# EAGLE design Powerboard (EAGLE 9.3.0)
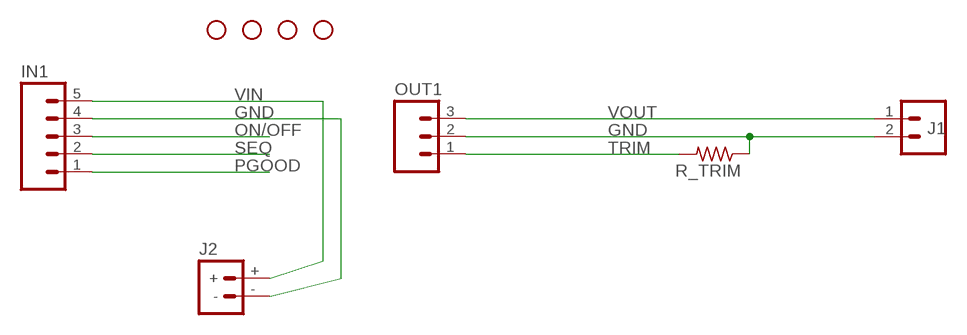
[diagram p0: schematic, sheet 1]

## Parts
IN1  M05PTH  [1X05]
J1  CONN_023.5MM  [SCREWTERMINAL-3.5MM-2]
J2  BATTERY_CONN_DEANS  [DEANS]
OUT1  M03PTH  [1X03]
R_TRIM  R-US_R0603  [R0603]
U$2  STAND-OFF  [STAND-OFF]
U$6  STAND-OFF  [STAND-OFF]
U$7  STAND-OFF  [STAND-OFF]
U$8  STAND-OFF  [STAND-OFF]

## Nets
GND: IN1.4 J1.2 J2.- OUT1.2 R_TRIM.1
ON/OFF: IN1.3
PGOOD: IN1.1
SEQ: IN1.2
TRIM: OUT1.1 R_TRIM.2
VIN: IN1.5 J2.+
VOUT: J1.1 OUT1.3

## Library data of the parts
IN1 = SparkFun:M05: Header 5 Standard 5-pin 0.1" header. Use with straight break away headers (SKU : PRT-00116), right angle break away headers (PRT-00553), swiss pins (PRT-00743), machine pins (PRT-00117), and female headers (PRT-00115). Molex polarized connector foot print use with SKU : PRT-08230 with associated crimp pins and housings.
J1 = SparkFun-Connectors:CONN_02: Multi connection point. Often used as Generic Header-pin footprint for 0.1 inch spaced/style header connections On any of the 0.1 inch spaced packages, you can populate with these: Break Away Headers - Straight <https://www.sparkfun.com/products/116> (PRT-00116) Break Away Male Headers - Right Angle <https://www.sparkfun.com/products/553> (PRT-00553) Female Headers <https://www.sparkfun.com/products/115> (PRT-00115) Break Away Headers - Machine Pin <https://www.sparkfun.com/products/117> (PRT-00117) Break Away Female Headers - Swiss Machine Pin <https://www.sparkfun.com/products/743> (PRT-00743) For SCREWTERMINALS and SPRING TERMINALS visit here: Screw Terimnals on SparkFun.com <https://www.sparkfun.com/search/results?term=Screw+Terminals> (5mm/3.5mm/2.54mm spacing) This device is also useful as a general connection point to wire up your design to another part of your project. Our various solder wires solder well into these plated through hole pads. Hook-Up Wire - Assortment (Stranded, 22 AWG) <https://www.sparkfun.com/products/11375> (PRT-11375) Hook-Up Wire - Assortment (Solid Core, 22 AWG) <https://www.sparkfun.com/products/11367> (PRT-11367) View the entire wire category on our website here <https://www.sparkfun.com/categories/141> Special notes: Molex polarized connector foot print use with: PRT-08233 with associated crimp pins and housings. 2.54_SCREWTERM for use with PRT-10571. 3.5mm Screw Terminal footprints for PRT-08084 5mm Screw Terminal footprints for use with PRT-08432; PROD_ID: CONN-08399
J2 = SparkFun-Connectors:BATTERY_CONN: Battery Connectors Various footprints for battery connections SparkFun Products: Deans Connector -M/F Pair <https://www.sparkfun.com/products/11864>; SF_ID: PRT-11864
OUT1 = SparkFun:M03: Header 3 Standard 3-pin 0.1" header. Use with straight break away headers (SKU : PRT-00116), right angle break away headers (PRT-00553), swiss pins (PRT-00743), machine pins (PRT-00117), and female headers (PRT-00115). Molex polarized connector foot print use with SKU : PRT-08232 with associated crimp pins and housings.
R_TRIM = rcl:R-US_: RESISTOR, American symbol; SPICEPREFIX: R
U$2 U$6-U$8 = SparkFun:STAND-OFF: Stand Off This is the mechanical footprint for a #4 phillips button head screw. Use the keepout ring to avoid running the screw head into surrounding components. SKU : PRT-00447

## Board
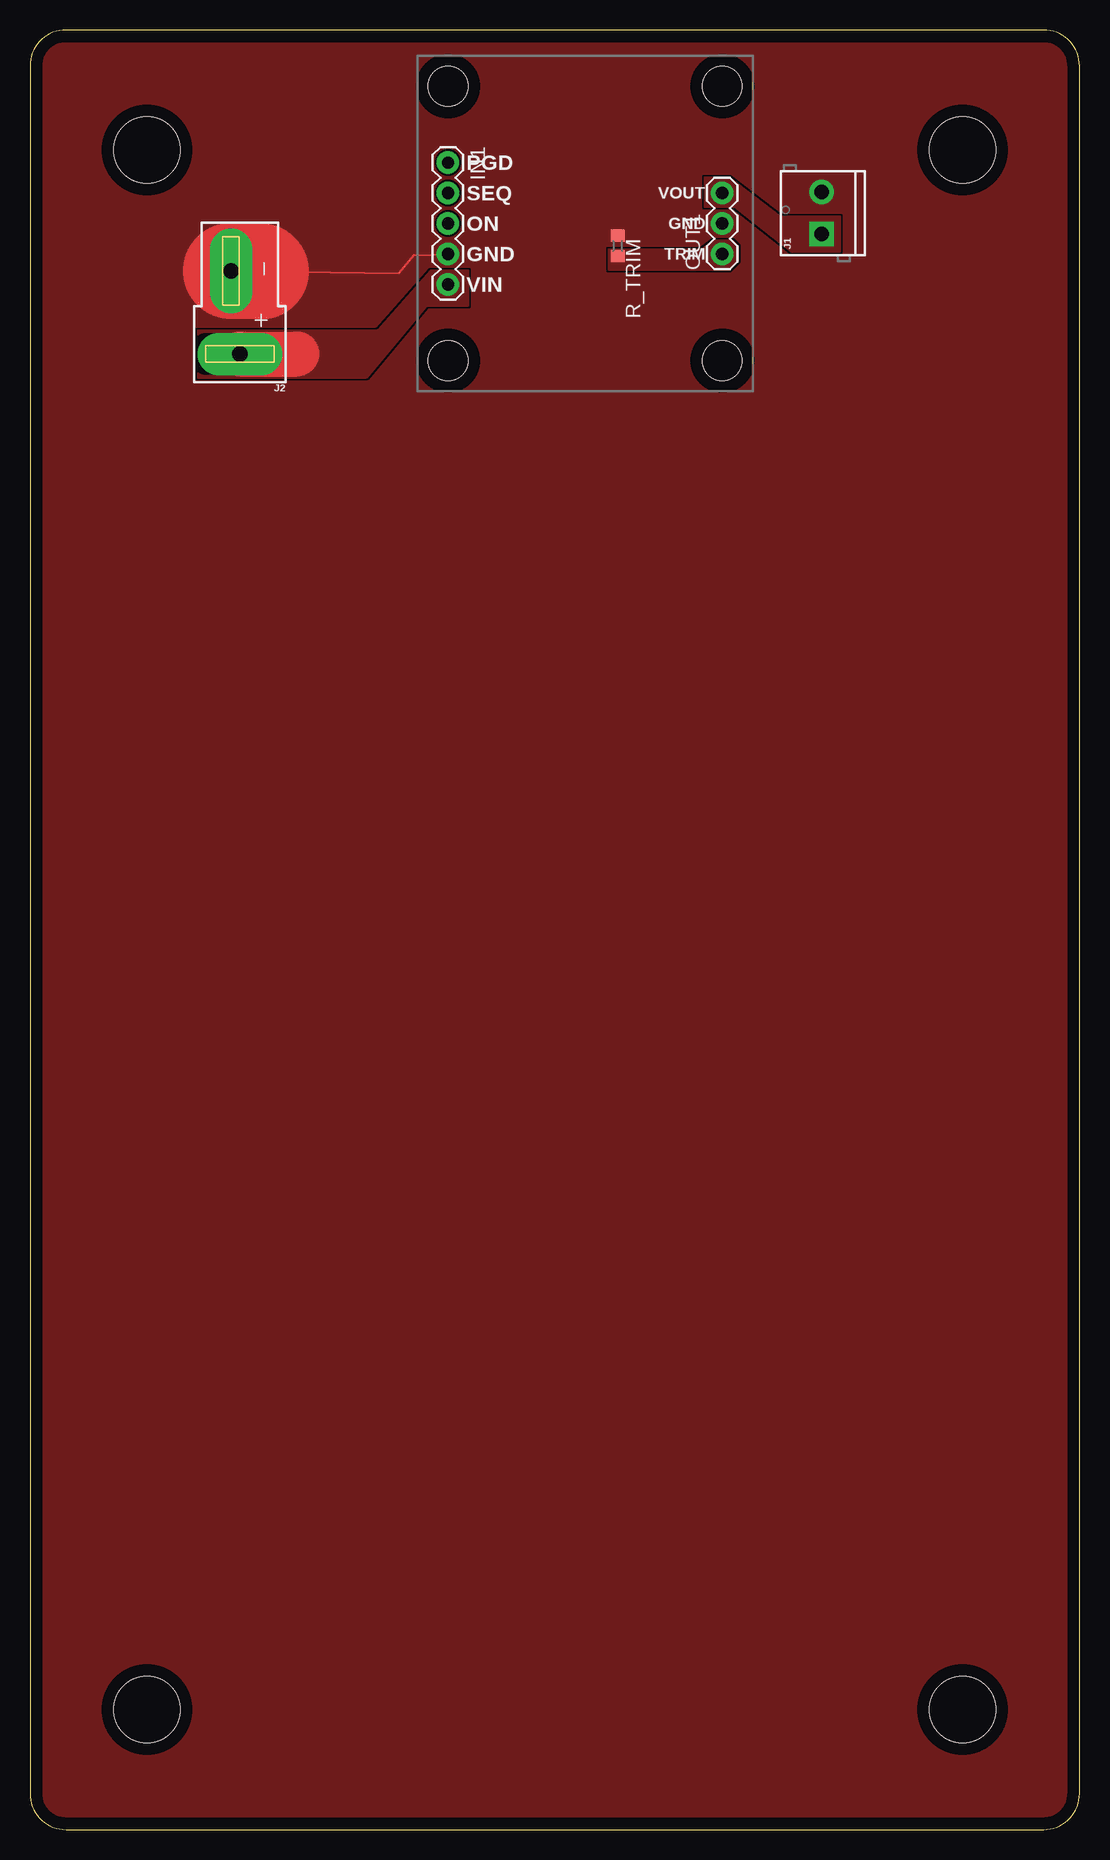
[diagram p1: board, top side]
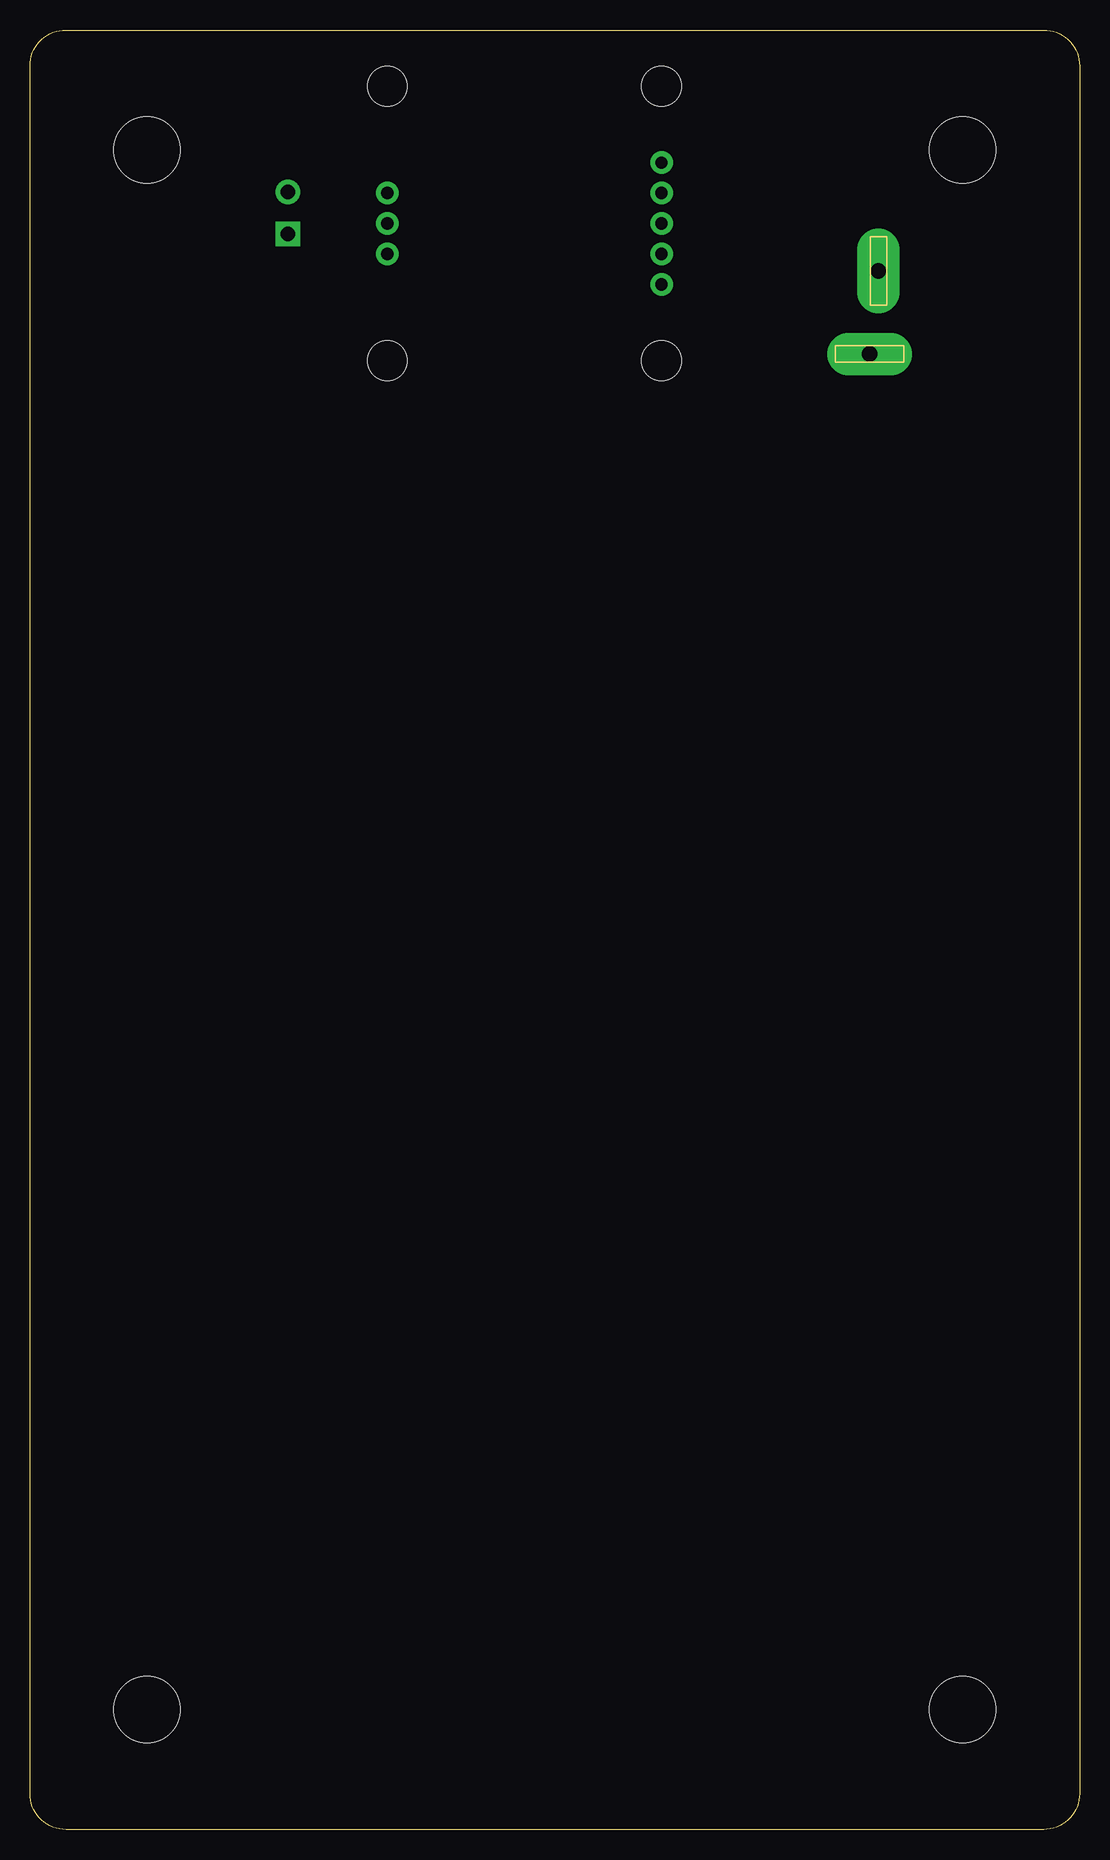
[diagram p2: board, bottom side, seen from below]

Size 87.5 x 150 mm. Coordinates in mm from the lower left corner, seen from the top.
Outline: 3,0 84.5,0 arc90 87.5,3 87.5,147 arc90 84.5,150 3,150 arc90 0,147 0,3 arc90 3,0
Copper layers (1*16): Top 0.035mm / dielectric 1.5mm / Bottom 0.035mm
Design rules "default": minimum track width 6mil, minimum drill 0.35mm, track to track 6mil, track to pad 6mil, pad to pad 6mil, via to via 6mil, smd to smd 6mil, copper to edge 40mil, drill to drill 6mil, minimum pad ring 10mil, minimum via ring 8mil, stop-mask expansion 4mil, vias tented up to drill 0mil, thermal gap 10mil
Holes 5.5 mm at 9.75,140 9.75,10 77.75,10 77.75,140
tKeepout: area 5.6,135.9 to 13.9,144.1; area 73.6,135.9 to 81.9,144.1; area 73.6,5.9 to 81.9,14.1; area 5.6,5.9 to 13.9,14.1

### Footprints (pad centres in the part's own frame; a part is rotated, then mirrored left to right if it is on the bottom)
1X05 = drill 1.016 pad 1.88: 1 0,0; 2 2.54,0; 3 5.08,0; 4 7.62,0; 5 10.16,0
SCREWTERMINAL-3.5MM-2 = drill 1.2 pad 2.032 square: 1 0,0 | drill 1.2 pad 2.032: 2 3.5,0
DEANS = drill 1.27 pad 3.556 long: + 0,0; - 0.737,-6.921
1X03 = drill 1.016 pad 1.88: 1 0,0; 2 2.54,0; 3 5.08,0
R0603 = smd 1 x 1.1: 1 -0.85,0; 2 0.85,0
STAND-OFF = hole 3.302: 0,0

### Placement (x,y rotation side)
IN1  34.85,138.95 270 top
J1  66,133 90 top
J2  17.5,123 180 top
OUT1  57.71,131.33 90 top
R_TRIM  49,132 270 top
U$2  34.85,145.3 270 top
U$6  34.85,122.44 270 top
U$7  57.71,145.3 270 top
U$8  57.71,122.44 270 top

### Tracks (layer width: path | path; a pad name or v marks a point on that pad's centre or on a via)
GND
  Top 0.152: 19.25,129.89 30.75,129.75 32,131.25 IN1.4
  Top 8: J2.- 19.25,129.89
  pour Top (no thermals): 13.5,126 18,125.5 13.5,125.5
  pour Top (rank 6, no thermals): 0,150 0,0 87.5,0 87.5,150
SEQ
  Bottom 0.254: 34.88,136.41 IN1.2 34.85,136.34
TRIM
  pour Top (no thermals): 48.25,131.75 49.75,131.75 56,131.75 57,132.5 58.5,132.5 59,132 59,130.75 58.25,130 48.25,130
VIN
  Top 3.75: J2.+ 22.25,123
  pour Top (no thermals): 14,125 29,125 33.44,130 36.5,130 36.5,127 33,127 28,121 14,121
VOUT
  pour Top (no thermals): 56.25,135.25 56.25,137.75 58.25,137.75 62.5,134.5 67.5,134.5 67.5,131.5 63.5,131.5 58.75,135.25

### Text on the board
tPlace: PGD | VOUT | SEQ | GND | ON | TRIM | GND | VIN
Measures: - | +
Document: uORocketry | Power Board | v1.0